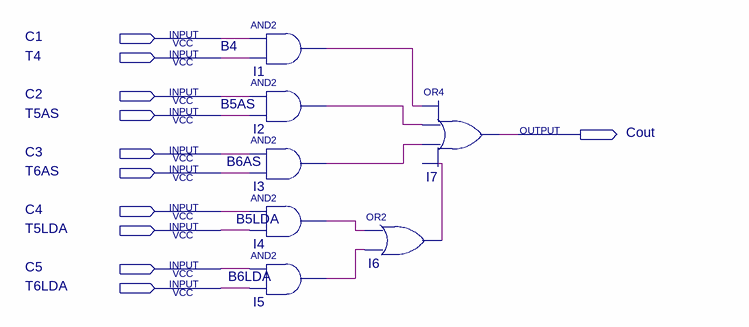
[diagram p0: schematic sheet]
// Quartus schematic MUX.bdf as structural Verilog: 7 symbols, 11 pins
module MUX (
  input  C1,
  input  T4,
  input  C2,
  input  T5AS,
  input  C3,
  input  T6AS,
  input  C4,
  input  T5LDA,
  input  C5,
  input  T6LDA,
  output Cout
);

  wire I1_out, I2_out, I3_out, I4_out, I5_out, I6_out;

  and I1 (I1_out, C1, T4);
  and I2 (I2_out, C2, T5AS);
  and I3 (I3_out, C3, T6AS);
  and I4 (I4_out, C4, T5LDA);
  and I5 (I5_out, C5, T6LDA);
  or I7 (Cout, I1_out, I2_out, I3_out, I6_out);
  or I6 (I6_out, I4_out, I5_out);

  // Other names for the same wires on the sheet: B4 = T4; B5AS = T5AS; B5LDA = T5LDA; B6AS = T6AS; B6LDA = T6LDA
endmodule
